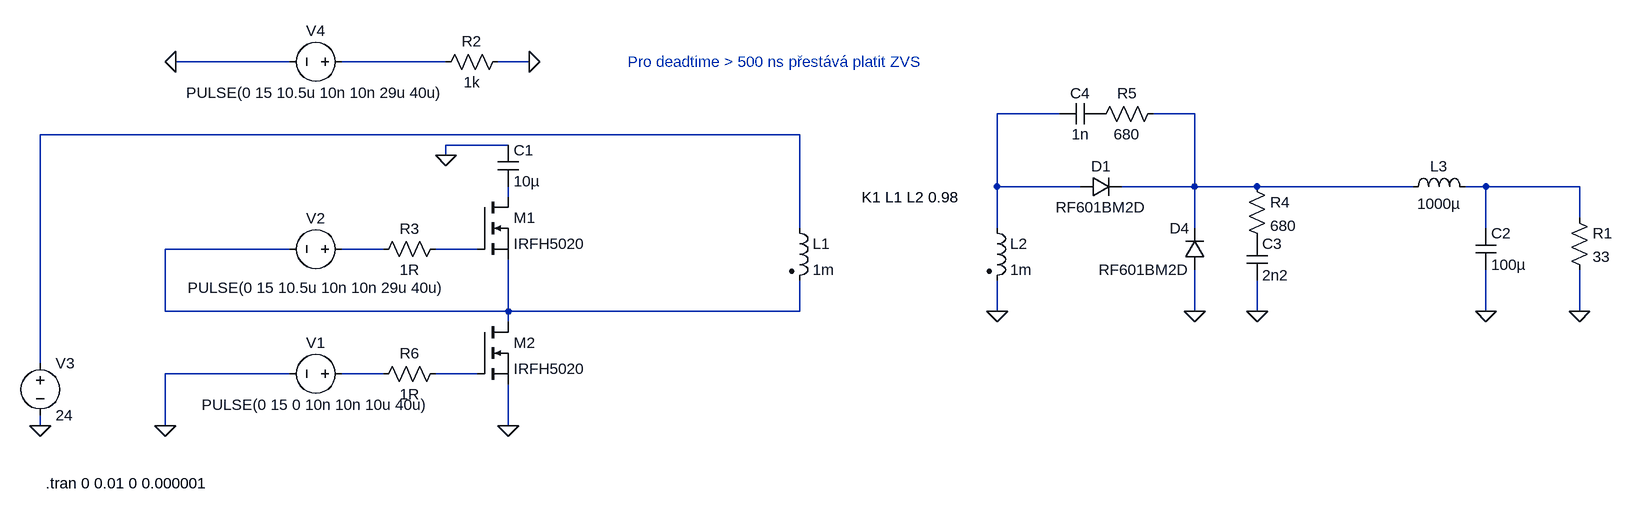
[diagram p0: schematic lt_spice_forward_gnd.asc]
lt_spice_forward_gnd.asc, the LTspice schematic file:
Version 4.1
SHEET 1 1912 680
WIRE -128 -144 -304 -144
WIRE 112 -144 -48 -144
WIRE 240 -144 192 -144
WIRE 1056 -64 960 -64
WIRE 1264 -64 1200 -64
WIRE 656 -32 -512 -32
WIRE 208 -16 112 -16
WIRE 112 0 112 -16
WIRE 960 48 960 -64
WIRE 1088 48 960 48
WIRE 1264 48 1264 -64
WIRE 1264 48 1152 48
WIRE 1360 48 1264 48
WIRE 1600 48 1360 48
WIRE 1712 48 1680 48
WIRE 1856 48 1712 48
WIRE 208 64 208 48
WIRE 1856 96 1856 48
WIRE 656 112 656 -32
WIRE 960 112 960 48
WIRE 1264 112 1264 48
WIRE 1712 112 1712 48
WIRE -128 144 -320 144
WIRE 16 144 -48 144
WIRE 160 144 96 144
WIRE -320 240 -320 144
WIRE 208 240 208 160
WIRE 208 240 -320 240
WIRE 656 240 656 192
WIRE 656 240 208 240
WIRE 960 240 960 192
WIRE 1264 240 1264 176
WIRE 1360 240 1360 192
WIRE 1712 240 1712 176
WIRE 1856 240 1856 176
WIRE 208 256 208 240
WIRE -512 320 -512 -32
WIRE -128 336 -320 336
WIRE 16 336 -48 336
WIRE 160 336 96 336
WIRE -512 416 -512 400
WIRE -320 416 -320 336
WIRE 208 416 208 352
FLAG 208 416 0
FLAG -320 416 0
FLAG -512 416 0
FLAG -304 -144 0
FLAG 240 -144 0
FLAG 1712 240 0
FLAG 1264 240 0
FLAG 960 240 0
FLAG 1856 240 0
FLAG 1360 240 0
FLAG 112 0 0
SYMBOL nmos 160 64 R0
SYMATTR InstName M1
SYMATTR Value IRFH5020
SYMBOL nmos 160 256 R0
SYMATTR InstName M2
SYMATTR Value IRFH5020
SYMBOL cap 192 -16 R0
SYMATTR InstName C1
SYMATTR Value 10µ
SYMBOL voltage -32 336 R90
WINDOW 0 -32 56 VBottom 2
WINDOW 3 32 56 VTop 2
WINDOW 123 0 0 Left 0
WINDOW 39 0 0 Left 0
SYMATTR InstName V1
SYMATTR Value PULSE(0 15 0 10n 10n 10u 40u)
SYMBOL voltage -32 144 R90
WINDOW 0 -32 56 VBottom 2
WINDOW 3 44 54 VTop 2
WINDOW 123 0 0 Left 0
WINDOW 39 0 0 Left 0
SYMATTR InstName V2
SYMATTR Value PULSE(0 15 10.5u 10n 10n 29u 40u)
SYMBOL voltage -512 304 R0
WINDOW 123 0 0 Left 0
WINDOW 39 0 0 Left 0
SYMATTR InstName V3
SYMATTR Value 24
SYMBOL ind2 640 96 R0
SYMATTR InstName L1
SYMATTR Value 1m
SYMATTR Type ind
SYMBOL voltage -32 -144 R90
WINDOW 0 -32 56 VBottom 2
WINDOW 3 32 56 VTop 2
WINDOW 123 0 0 Left 0
WINDOW 39 0 0 Left 0
SYMATTR InstName V4
SYMATTR Value PULSE(0 15 10.5u 10n 10n 29u 40u)
SYMBOL res 208 -160 R90
WINDOW 0 0 56 VBottom 2
WINDOW 3 32 56 VTop 2
SYMATTR InstName R2
SYMATTR Value 1k
SYMBOL ind2 944 96 R0
SYMATTR InstName L2
SYMATTR Value 1m
SYMATTR Type ind
SYMBOL diode 1088 64 R270
WINDOW 0 32 32 VTop 2
WINDOW 3 0 32 VBottom 2
SYMATTR InstName D1
SYMATTR Value RF601BM2D
SYMBOL diode 1280 176 R180
WINDOW 0 24 64 Left 2
WINDOW 3 24 0 Left 2
SYMATTR InstName D4
SYMATTR Value RF601BM2D
SYMBOL ind 1584 64 R270
WINDOW 0 32 56 VTop 2
WINDOW 3 5 56 VBottom 2
SYMATTR InstName L3
SYMATTR Value 1000µ
SYMBOL cap 1696 112 R0
SYMATTR InstName C2
SYMATTR Value 100µ
SYMBOL res 1840 80 R0
SYMATTR InstName R1
SYMATTR Value 33
SYMBOL res 1344 32 R0
SYMATTR InstName R4
SYMATTR Value 680
SYMBOL cap 1344 128 R0
SYMATTR InstName C3
SYMATTR Value 2n2
SYMBOL res 1216 -80 R90
WINDOW 0 0 56 VBottom 2
WINDOW 3 32 56 VTop 2
SYMATTR InstName R5
SYMATTR Value 680
SYMBOL cap 1120 -80 R90
WINDOW 0 0 32 VBottom 2
WINDOW 3 32 32 VTop 2
SYMATTR InstName C4
SYMATTR Value 1n
SYMBOL res 112 128 R90
WINDOW 0 0 56 VBottom 2
WINDOW 3 32 56 VTop 2
SYMATTR InstName R3
SYMATTR Value 1R
SYMBOL res 112 320 R90
WINDOW 0 0 56 VBottom 2
WINDOW 3 32 56 VTop 2
SYMATTR InstName R6
SYMATTR Value 1R
TEXT -504 504 Left 2 !.tran 0 0.01 0 0.000001
TEXT 752 64 Left 2 !K1 L1 L2 0.98
TEXT 392 -144 Left 2 ;Pro deadtime > 500 ns přestává platit ZVS

The netlist it stands for:
* lt_spice_forward_gnd.asc
M1 N006 N009 N007 N007 IRFH5020
M2 N007 N011 0 0 IRFH5020
C1 0 N006 10µ
V1 N010 0 PULSE(0 15 0 10n 10n 10u 40u)
V2 N008 N007 PULSE(0 15 10.5u 10n 10n 29u 40u)
V3 N004 0 24
L1 N004 N007 1m
V4 N001 0 PULSE(0 15 10.5u 10n 10n 29u 40u)
R2 0 N001 1k
L2 N002 0 1m
D1 N002 N003 RF601BM2D
D4 0 N003 RF601BM2D
L3 N003 N005 1000µ
C2 N005 0 100µ
R1 N005 0 33
R4 N003 P001 680
C3 P001 0 2n2
R5 N003 P002 680
C4 P002 N002 1n
R3 N009 N008 1R
R6 N011 N010 1R
.model D D
.lib standard.dio
.model NMOS NMOS
.model PMOS PMOS
.lib standard.mos
.tran 0 0.01 0 0.000001
K1 L1 L2 0.98
* Pro deadtime > 500 ns přestává platit ZVS
.backanno
.end